# EAGLE design Board (EAGLE 9.0.1)
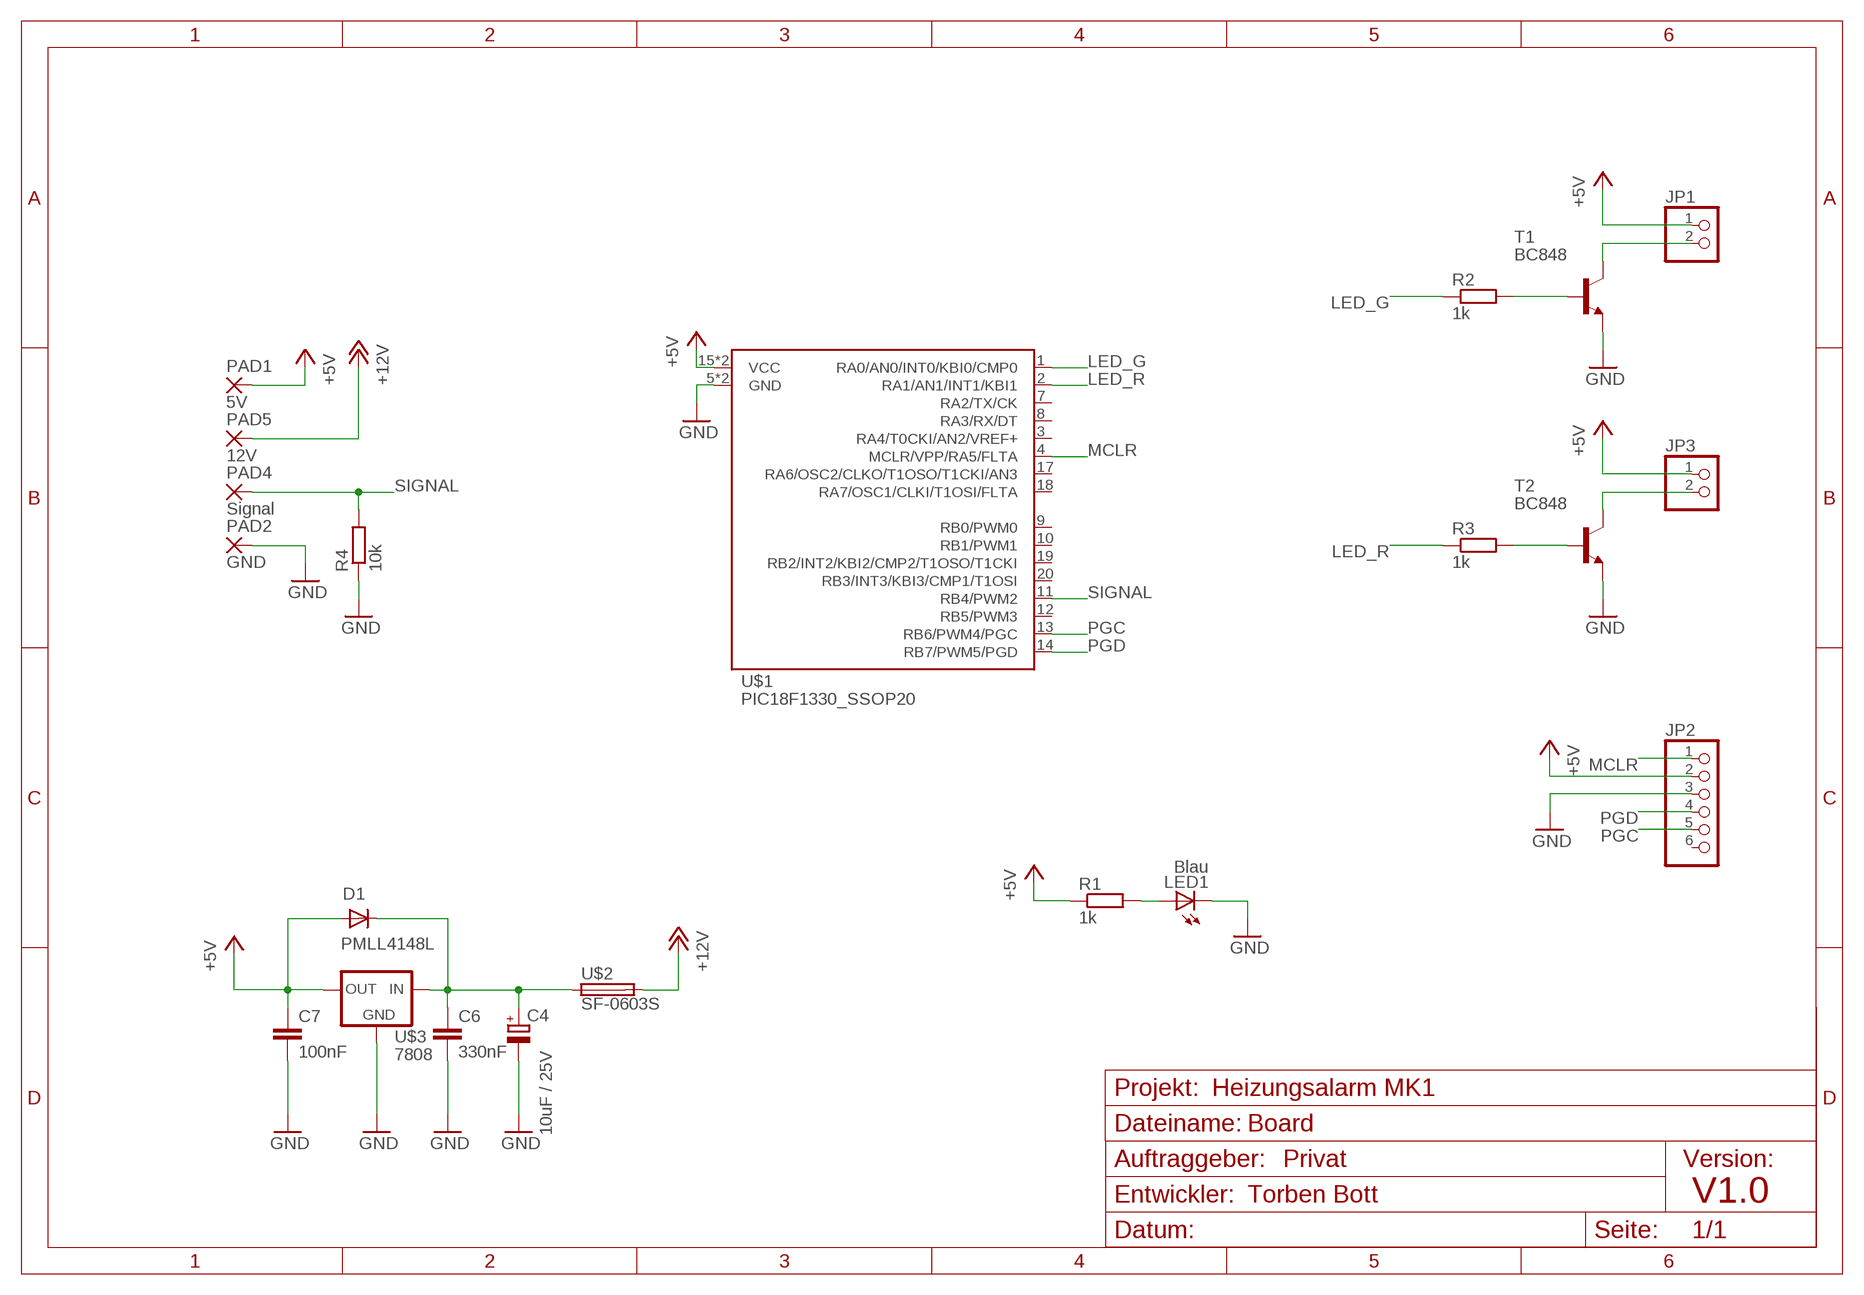
[diagram p0: schematic, sheet 1]

## Parts
C4  10uF / 25V  CPOL-EUD/7343-31R  [D/7343-31R]
C6  330nF  C-EUC0805  [C0805]
C7  100nF  C-EUC0805  [C0805]
D1  PMLL4148L  [SOD80C]
JP1  PINHD-1X2/90  [1X02/90]
JP2  PINHD-1X6  [1X06]
JP3  PINHD-1X2/90  [1X02/90]
LED1  Blau  LEDCHIP-LED0805  [CHIP-LED0805]
PAD1  5V  WIREPADSMD5-1,8  [5-1,8]
PAD2  GND  WIREPADSMD5-1,8  [5-1,8]
PAD4  Signal  WIREPADSMD5-1,8  [5-1,8]
PAD5  12V  WIREPADSMD5-1,8  [5-1,8]
R1  1k  R-EU_R0805  [R0805]
R2  1k  R-EU_R0805  [R0805]
R3  1k  R-EU_R0805  [R0805]
R4  10k  R-EU_R0805  [R0805]
T1  BC848  [SOT23]
T2  BC848  [SOT23]
U$1  PIC18F1330_SSOP20  [SSOP20]
U$2  SF-0603S  [R0603]
U$3  7808  78XX_(SOT89)  [SOT89]

## Nets
+5V: C7.1 D1.2(A) JP1.1 JP2.2 JP3.1 PAD1.1(P) R1.1 U$1.15(VCC) U$1.16(VCC) U$3.1(IN)
+12V: PAD5.1(P) U$2.2
GND: C4.- C6.2 C7.2 JP2.3 LED1.C PAD2.1(P) R4.1 T1.2(E) T2.2(E) U$1.5(GND) U$1.6(GND) U$3.2(GND) U$3.2@1(GND)
LED_G: R2.1 U$1.1(RA0/AN0/INT0/KBI0/CMP0)
LED_R: R3.1 U$1.2(RA1/AN1/INT1/KBI1)
MCLR: JP2.1 U$1.4(MCLR/VPP/RA5/FLTA)
N$1: R2.2 T1.1(B)
N$2: LED1.A R1.2
N$3: C4.+ C6.1 D1.1(K) U$2.1 U$3.3(OUT)
N$4: JP1.2 T1.3(C)
N$5: R3.2 T2.1(B)
N$6: JP3.2 T2.3(C)
PGC: JP2.5 U$1.13(RB6/PWM4/PGC)
PGD: JP2.4 U$1.14(RB7/PWM5/PGD)
SIGNAL: PAD4.1(P) R4.2 U$1.11(RB4/PWM2)
Unconnected: JP2.6 U$1.3(RA4/T0CKI/AN2/VREF+) U$1.7(RA2/TX/CK) U$1.8(RA3/RX/DT) U$1.9(RB0/PWM0) U$1.10(RB1/PWM1) U$1.12(RB5/PWM3) U$1.17(RA6/OSC2/CLKO/T1OSO/T1CKI/AN3) U$1.18(RA7/OSC1/CLKI/T1OSI/FLTA) U$1.19(RB2/INT2/KBI2/CMP2/T1OSO/T1CKI) U$1.20(RB3/INT3/KBI3/CMP1/T1OSI)

## Notes on the sheet
- Heizungsalarm MK1
- Privat
- Torben Bott | V1.0

## Library data of the parts
C4 = rcl:CPOL-EU: POLARIZED CAPACITOR, European symbol; SPICEPREFIX: C
C6 C7 = rcl:C-EU: CAPACITOR, European symbol; SPICEPREFIX: C
D1 = nxp_60:PMLL4148L: Single high-speed switching diodes, fabricated in planar technology, and encapsulated in small hermetically sealed glass SOD80C Surface-Mounted Device (SMD) packages. AAL Eindhoven MK; FARNELL: 1097176
JP1 JP3 = pinhead:PINHD-1X2: PIN HEADER
JP2 = pinhead:PINHD-1X6: PIN HEADER
LED1 = led:LED: LED OSRAM: - CHIPLED LG R971, LG N971, LY N971, LG Q971, LY Q971, LO R971, LY R971 LH N974, LH R974 LS Q976, LO Q976, LY Q976 LO Q996 - Hyper CHIPLED LW Q18S LB Q993, LB Q99A, LB R99A - SideLED LS A670, LO A670, LY A670, LG A670, LP A670 LB A673, LV A673, LT A673, LW A673 LH A674 LY A675 LS A676, LA A676, LO A676, LY A676, LW A676 LS A679, LY A679, LG A679 - Hyper Micro SIDELED® LS Y876, LA Y876, LO Y876, LY Y876 LT Y87S - SmartLED LW L88C, LW L88S LB L89C, LB L89S, LG L890 LS L89K, LO L89K, LY L89K LS L896, LA L896, LO L896, LY L896 - TOPLED LS T670, LO T670, LY T670, LG T670, LP T670 LSG T670, LSP T670, LSY T670, LOP T670, LYG T670 LG T671, LOG T671, LSG T671 LB T673, LV T673, LT T673, LW T673 LH T674 LS T676, LA T676, LO T676, LY T676, LB T676, LH T676, LSB T676, LW T676 LB T67C, LV T67C, LT T67C, LS T67K, LO T67K, LY T67K, LW E67C LS E67B, LA E67B, LO E67B, LY E67B, LB E67C, LV E67C, LT E67C LW T67C LS T679, LY T679, LG T679 LS T770, LO T770, LY T770, LG T770, LP T770 LB T773, LV T773, LT T773, LW T773 LH T774 LS E675, LA E675, LY E675, LS T675 LS T776, LA T776, LO T776, LY T776, LB T776 LHGB T686 LT T68C, LB T68C - Hyper Mini TOPLED® LB M676 - Mini TOPLED Santana® LG M470 LS M47K, LO M47K, LY M47K Source: http://www.osram.convergy.de LUXEON: - LUMILED® LXK2-PW12-R00, LXK2-PW12-S00, LXK2-PW14-U00, LXK2-PW14-V00 LXK2-PM12-R00, LXK2-PM12-S00, LXK2-PM14-U00 LXK2-PE12-Q00, LXK2-PE12-R00, LXK2-PE12-S00, LXK2-PE14-T00, LXK2-PE14-U00 LXK2-PB12-K00, LXK2-PB12-L00, LXK2-PB12-M00, LXK2-PB14-N00, LXK2-PB14-P00, LXK2-PB14-Q00 LXK2-PR12-L00, LXK2-PR12-M00, LXK2-PR14-Q00, LXK2-PR14-R00 LXK2-PD12-Q00, LXK2-PD12-R00, LXK2-PD12-S00 LXK2-PH12-R00, LXK2-PH12-S00 LXK2-PL12-P00, LXK2-PL12-Q00, LXK2-PL12-R00 Source: www.luxeon.com KINGBRIGHT: KA-3528ASYC Source: www.kingbright.com
PAD1 PAD2 PAD4 PAD5 = wirepad:WIREPAD: Wire PAD connect wire on PCB
R1-R4 = rcl:R-EU_: RESISTOR, European symbol; SPICEPREFIX: R
T1 T2 = transistor:BC848: NPN TRANSISTOR
U$1 = Eigene Library:PIC18F1330_SSOP20: Conrad: 1083798-62 Farnell: 132-4379
U$2 = Eigene Library:SF-0603S; FARNELL: 1652144
U$3 = Eigene Library:78XX_(SOT89): Farnell: 170-3362

## Board
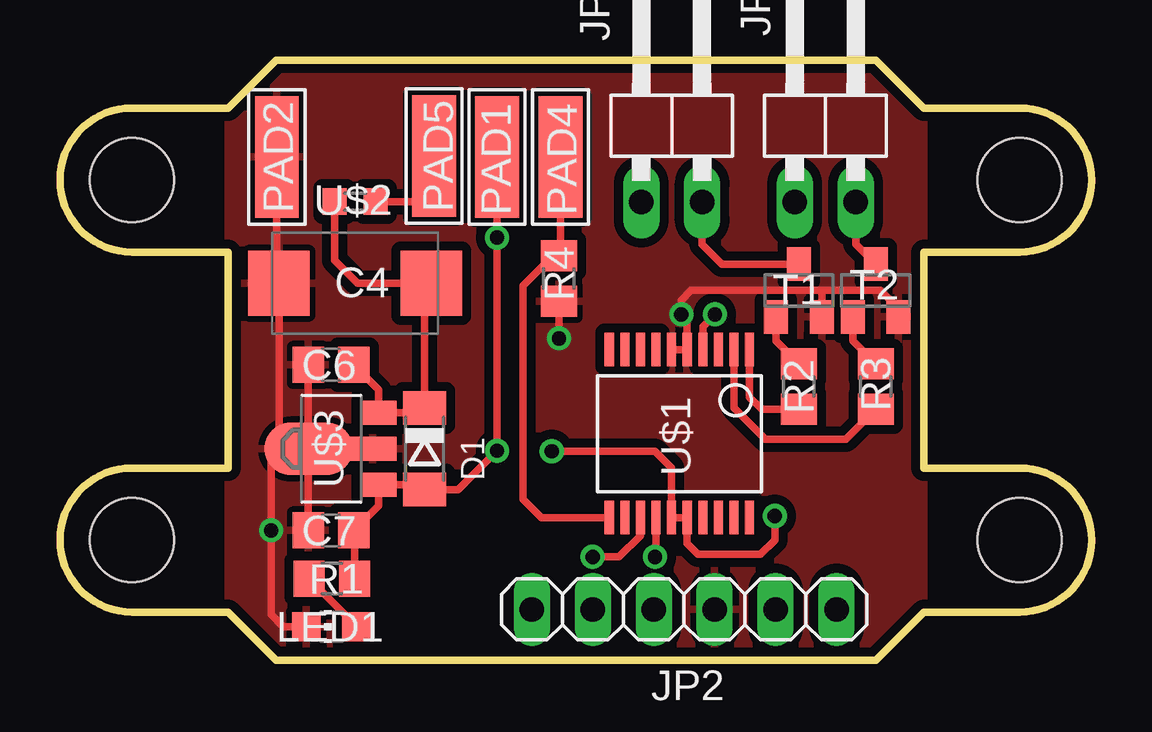
[diagram p1: board, top side]
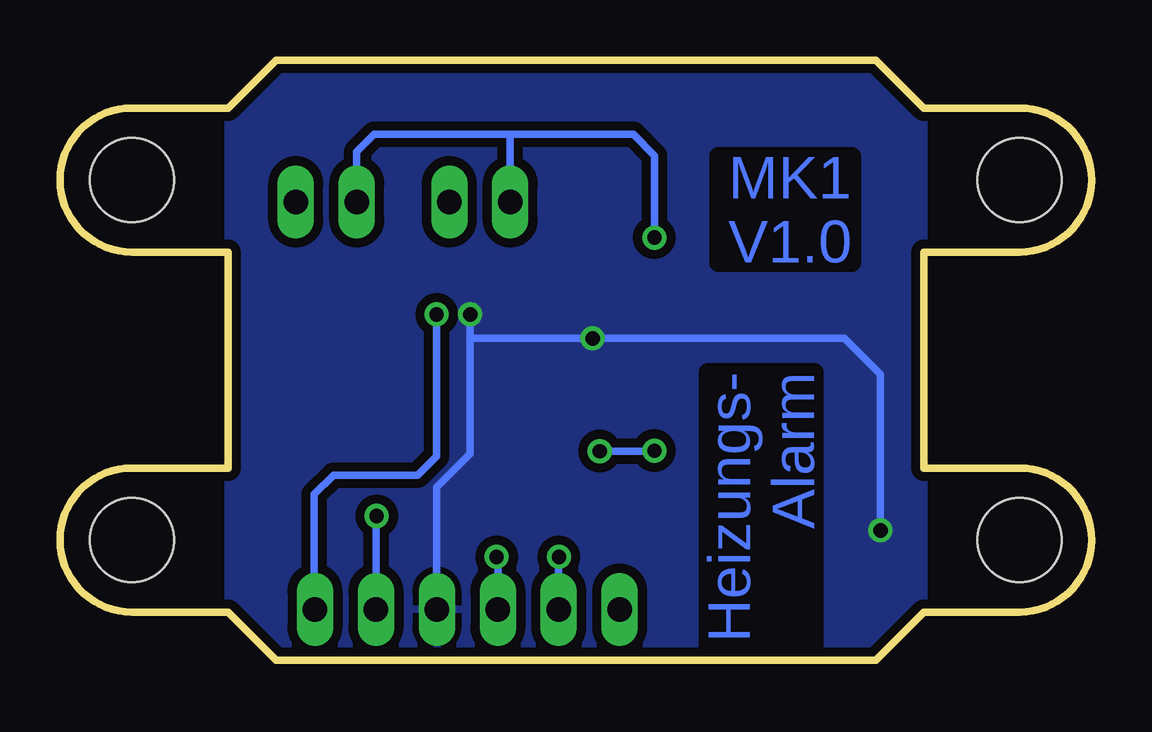
[diagram p2: board, bottom side, seen from below]

Size 43 x 25 mm. Coordinates in mm from the lower left corner, seen from the top.
Outline: 9,0 34,0 36,2 40,2 arc90 43,5 arc90 40,8 36,8 36,17 40,17 arc90 43,20 arc90 40,23 36,23 34,25 9,25 7,23 3,23 arc90 0,20 arc90 3,17 7,17 7,8 3,8 arc90 0,5 arc90 3,2 7,2 9,0
Copper layers (1*16): Top 0.035mm / dielectric 1.5mm / Bottom 0.035mm
Design rules "Torben": minimum track width 12mil, minimum drill 0.6mm, track to track 15mil, track to pad 8mil, pad to pad 6mil, via to via 6mil, smd to smd 6mil, copper to edge 15mil, drill to drill 6mil, minimum pad ring 10mil, minimum via ring 8mil, stop-mask expansion 4mil, vias tented up to drill 0mil, thermal gap 10mil
Holes 3.5 mm at 3,20 3,5 40,5 40,20

### Footprints (pad centres in the part's own frame; a part is rotated, then mirrored left to right if it is on the bottom)
D/7343-31R = smd 2.55 x 2.7: + 3.175,0; - -3.175,0
C0805 = smd 1.3 x 1.5: 1 -0.95,0; 2 0.95,0
SOD80C = smd 1.4 x 1.8: 1 -1.7,0; 2 1.7,0
1X02/90 = drill 1.016 long: 1 -1.27,-3.81; 2 1.27,-3.81
1X06 = drill 1.016 long: 1 -6.35,0; 2 -3.81,0; 3 -1.27,0; 4 1.27,0; 5 3.81,0; 6 6.35,0
CHIP-LED0805 = smd 1.2 x 1.2: A 0,-1.05; C 0,1.05
5-1,8 = smd 1.829 x 5.08: 1 0,0
R0805 = smd 1.3 x 1.5: 1 -0.95,0; 2 0.95,0
SOT23 = smd 1 x 1.4: 1 -0.95,-1.1; 2 0.95,-1.1; 3 0,1.1
SSOP20 = smd 0.38 x 1.4: 1 -2.925,-3.5; 2 -2.275,-3.5; 3 -1.625,-3.5; 4 -0.975,-3.5; 5 -0.325,-3.5; 6 0.325,-3.5; 7 0.975,-3.5; 8 1.625,-3.5; 9 2.275,-3.5; 10 2.925,-3.5; 11 2.925,3.5; 12 2.275,3.5; 13 1.625,3.5; 14 0.975,3.5; 15 0.325,3.5; 16 -0.325,3.5; 17 -0.975,3.5; 18 -1.625,3.5; 19 -2.275,3.5; 20 -2.925,3.5
R0603 = smd 1 x 1.1: 1 -0.85,0; 2 0.85,0
SOT89 = smd 1 x 1.5: 1 -1.499,-1.981; 3 1.499,-1.981 | smd 1 x 2: 2 0,-1.727 | smd 2.2 x 3.7: 2@1 0,0.94

### Placement (x,y rotation side)
C4  12.3,15.7 0 top
C6  11.3,12.3 180 top
C7  11.3,5.4 180 top
D1  15.2,8.8 270 top
JP1  25.5,22.9 0 top
JP2  26.02,2.11 180 top
JP3  31.9,22.9 0 top
LED1  11.32,1.39 90 top
PAD1  18.22,20.96 180 top
PAD2  9.04,20.96 180 top
PAD4  20.86,20.96 180 top
PAD5  15.6,21 180 top
R1  11.33,3.39 180 top
R2  30.8,11.4 90 top
R3  34,11.4 90 top
R4  20.8,15.9 90 top
T1  30.8,15.4 0 top
T2  34,15.4 0 top
U$1  25.82,9.43 180 top
U$2  12.3,19.1 0 top
U$3  11.3,8.8 90 top

### Tracks (layer width: path | path; a pad name or v marks a point on that pad's centre or on a via)
+5V  (via drill 0.6)
  Top 0.305: PAD1.1 v18.22,17.6 v18.22,8.72 16.6,7.1 D1.2 15,7.3 U$3.1 13.28,6.43 C7.1 12.28,5.37 R1.1 | v29.8,6 29.8,5 29.2,4.4 26.6,4.4 26.14,4.86 U$1.16 U$1.15 25.49,8 24.8,8.7 v20.5,8.7
  Bottom 0.305: JP2.2 29.83,5.97 v29.8,6 | JP3.1 30.63,21.17 29.9,21.9 24.3,21.9 | v18.22,17.6 18.22,21.02 19.1,21.9 24.3,21.9 | JP1.1 24.23,21.83 24.3,21.9 | v20.5,8.7 18.3,8.7 18.22,8.78 | 18.2,8.8 18.22,8.78 | 18.22,8.78 v18.22,8.72
+12V
  Top 0.305: U$2.2 15,19.1 15.8,19.9 15.6,20.1 PAD5.1
GND  (via drill 0.6)
  Top 0.305: C7.2 U$3.2@1 | U$3.2@1 U$3.2 | C6.2 U$3.2@1 | 9.25,8.95 9.12,9.07 C4.- 9.04,15.78 PAD2.1 | 9.25,8.95 9.8,8.4 10.19,8.79 U$3.2@1 | R4.1 v20.8,13.4 | 9.25,8.95 8.8,8.5 v8.8,5.4 8.8,1.9 9.31,1.39 LED1.C | U$1.6 U$1.5 26.14,14.16 v25.9,14.4 25.9,15 26.3,15.4 31.7,15.4 | T2.2 34.95,14.65 34.2,15.4 31.7,15.4 | T1.2 31.75,15.35 31.7,15.4
  Bottom 0.305: v25.9,14.4 25.9,13.3 | 25.9,13.3 25.9,8.6 27.3,7.2 JP2.3 | 25.9,13.3 25.8,13.4 v20.8,13.4 10.3,13.4 8.8,11.9 v8.8,5.4
  pour Bottom: 9,25 7,23 7,2 9,0 34,0 36,2 36,23 34,25
  pour Top: 9,25 7,23 7,2 9,0 34,0 36,2 36,23 34,25
LED_G
  Top 0.305: U$1.1 28.74,10.95 29.25,10.45 R2.1
LED_R
  Top 0.305: U$1.2 28.09,10.51 29.4,9.2 32.75,9.2 R3.1
MCLR  (via drill 0.6)
  Top 0.305: U$1.4 26.8,13.9 v27.3,14.4
  Bottom 0.305: v27.3,14.4 27.3,8.5 28.1,7.7 31.6,7.7 32.4,6.9 32.4,2.14 JP2.1
N$1
  Top 0.305: T1.1 29.85,13.3 R2.2
N$2
  Top 0.305: LED1.A 11.49,2.28 11.48,2.28 11.27,2.49 11.27,2.5 R1.2
N$3
  Top 0.305: C6.1 13.28,11.27 U$3.3 15,10.3 D1.1 15.2,15.42 C4.+ 12.4,15.7 11.45,16.65 U$2.1
N$4
  Top 0.305: JP1.2 26.77,17.33 27.6,16.5 T1.3
N$5
  Top 0.305: T2.1 33.05,13.3 R3.2
N$6
  Top 0.305: T2.3 33.17,17.33 JP3.2
PGC  (via drill 0.6)
  Top 0.305: v22.2,4.3 23.31,4.3 24.2,5.19 U$1.13
  Bottom 0.305: JP2.5 v22.21,4.29 v22.2,4.3
PGD  (via drill 0.6)
  Top 0.305: U$1.14 24.84,4.34 v24.8,4.3
  Bottom 0.305: JP2.4 24.75,4.25 v24.8,4.3
SIGNAL
  Top 0.305: PAD4.1 20.86,16.91 R4.2 20.55,16.85 19.3,15.6 19.3,6.7 20.07,5.93 U$1.11

### Text on the board
Bottom: MK1 / V1.0 | Heizungs- / Alarm